# EAGLE design PIC32MX250_NU (EAGLE 5.12)
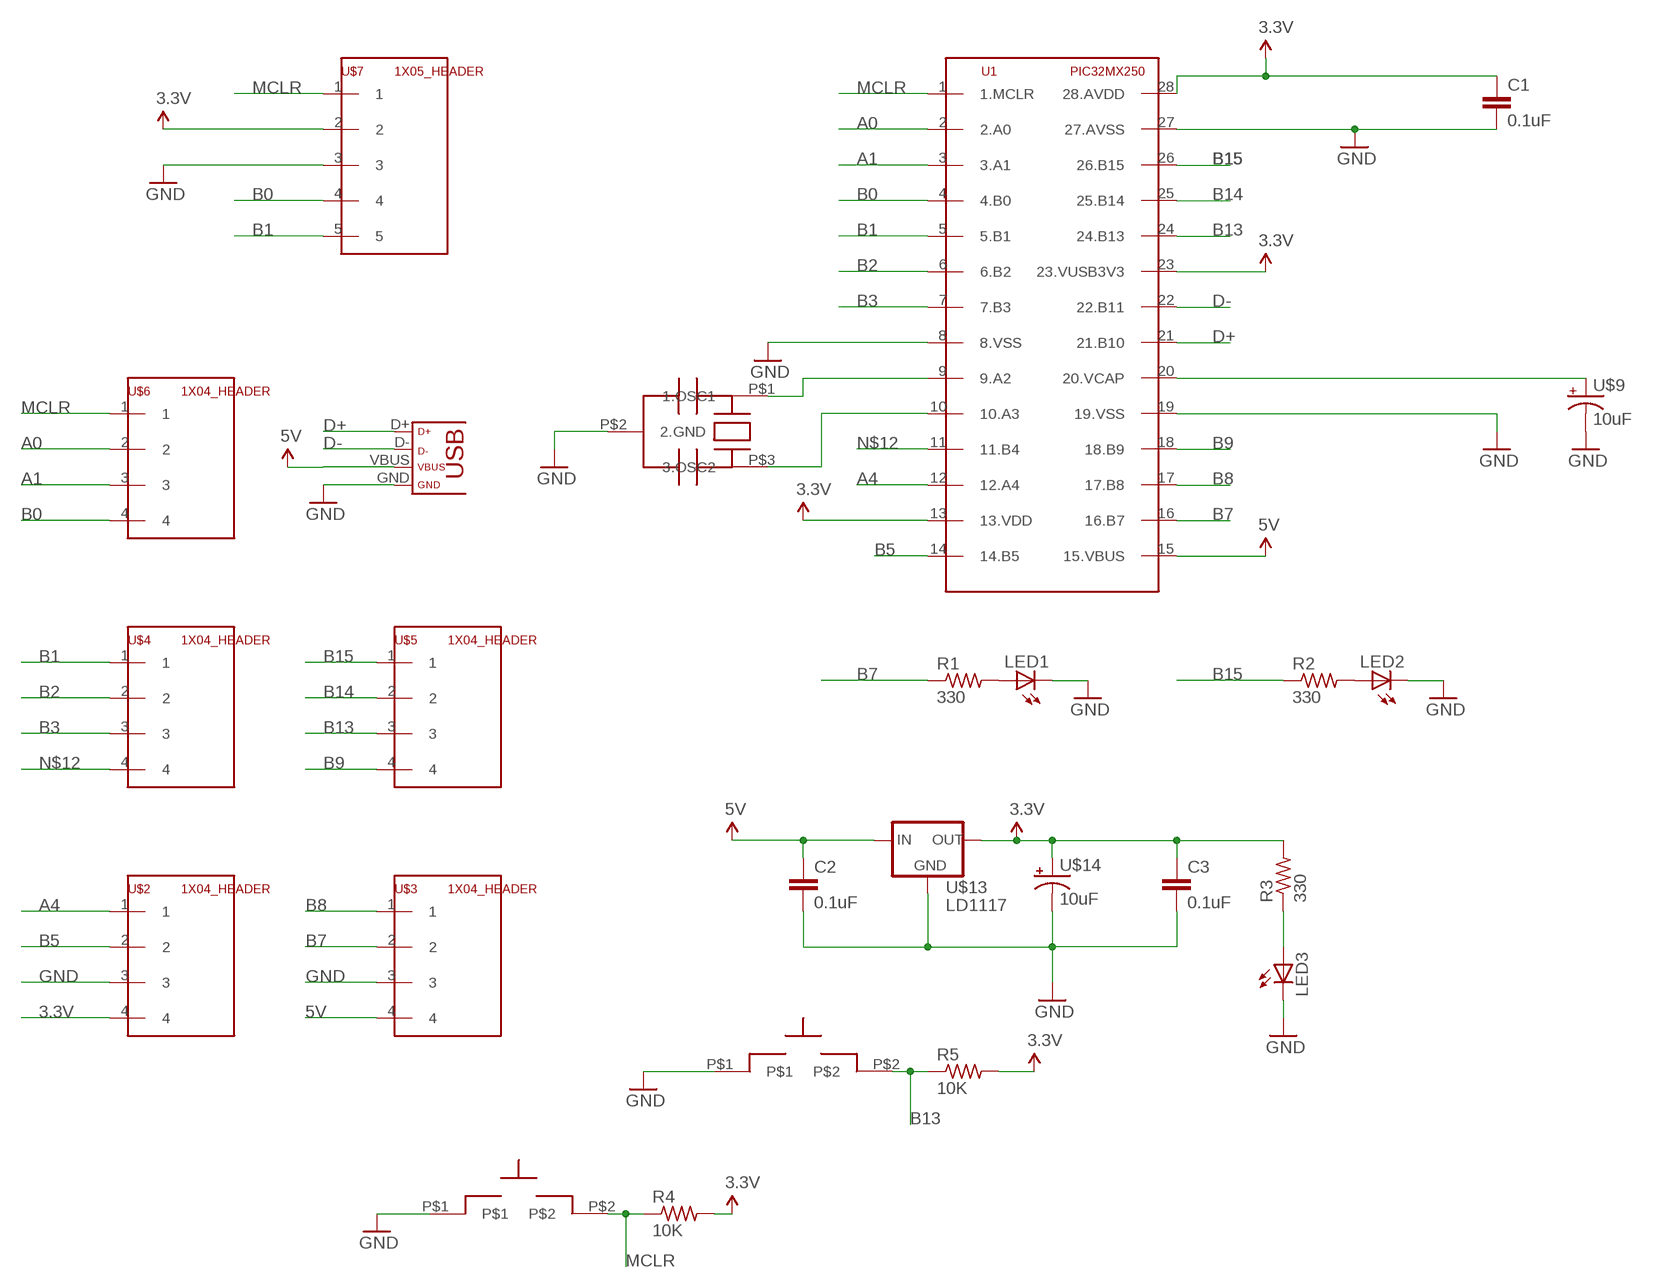
[diagram p0: schematic, sheet 1]

## Parts
C1  0.1uF  C2,5-3  [C2.5-3]
C2  0.1uF  C2,5-3  [C2.5-3]
C3  0.1uF  C2,5-3  [C2.5-3]
LED1  LED3MM  [LED3MM]
LED2  LED3MM  [LED3MM]
LED3  LED3MM  [LED3MM]
R1  330  R-US_0309/12  [0309/12]
R2  330  R-US_0309/12  [0309/12]
R3  330  R-US_0309/12  [0309/12]
R4  10K  R-US_0309/12  [0309/12]
R5  10K  R-US_0309/12  [0309/12]
U1  PIC32MX250  [DIL28-3]
U$2  1X04_HEADER  [1X04]
U$3  1X04_HEADER  [1X04]
U$4  1X04_HEADER  [1X04]
U$5  1X04_HEADER  [1X04]
U$6  1X04_HEADER  [1X04]
U$7  1X05_HEADER  [1X05]
U$9  10uF  CAP_POL  [CAP_POL_D]
U$11  USB  [USB-MINIB]
U$13  LD1117  [TO220]
U$14  10uF  CAP_POL  [CAP_POL_D]
U$15  8MHZ_RESONATOR  [8MHZ_RESONATOR]
U$16  BUTTON  [BUTTON]
U$17  BUTTON  [BUTTON]

## Nets
3.3V: C1.1 C3.1 R3.2 R4.2 R5.2 U1.13(13.VDD) U1.23(23.VUSB3V3) U1.28(28.AVDD) U$2.4 U$7.2 U$13.2(OUT) U$14.1(+)
5V: C2.1 U1.15(15.VBUS) U$3.4 U$11.VBUS U$13.3(IN)
A0: U1.2(2.A0) U$6.2
A1: U1.3(3.A1) U$6.3
A4: U1.12(12.A4) U$2.1
B0: U1.4(4.B0) U$6.4 U$7.4
B1: U1.5(5.B1) U$4.1 U$7.5
B2: U1.6(6.B2) U$4.2
B3: U1.7(7.B3) U$4.3
B5: U1.14(14.B5) U$2.2
B7: R1.1 U1.16(16.B7) U$3.2
B8: U1.17(17.B8) U$3.1
B9: U1.18(18.B9) U$5.4
B13: R5.1 U1.24(24.B13) U$5.3 U$16.P$2
B14: U1.25(25.B14) U$5.2
B15: R2.1 U1.26(26.B15) U$5.1
D+: U1.21(21.B10) U$11.D+
D-: U1.22(22.B11) U$11.D-
GND: C1.2 C2.2 C3.2 LED1.K(C) LED2.K(C) LED3.K(C) U1.8(8.VSS) U1.19(19.VSS) U1.27(27.AVSS) U$2.3 U$3.3 U$7.3 U$9.2(-) U$11.GND U$13.1(GND) U$14.2(-) U$15.P$2(2.GND) U$16.P$1 U$17.P$1
MCLR: R4.1 U1.1(1.MCLR) U$6.1 U$7.1 U$17.P$2
N$2: U1.9(9.A2) U$15.P$1(1.OSC1)
N$3: U1.20(20.VCAP) U$9.1(+)
N$4: LED1.A R1.2
N$5: LED2.A R2.2
N$6: LED3.A R3.1
N$11: U1.10(10.A3) U$15.P$3(3.OSC2)
N$12: U1.11(11.B4) U$4.4

## Library data of the parts
C1-C3 = ME433:C: CAPACITOR naming: grid - package width
LED1-LED3 = led:LED: LED OSRAM: - CHIPLED LG R971, LG N971, LY N971, LG Q971, LY Q971, LO R971, LY R971 LH N974, LH R974 LS Q976, LO Q976, LY Q976 LO Q996 - Hyper CHIPLED LW Q18S LB Q993, LB Q99A, LB R99A - SideLED LS A670, LO A670, LY A670, LG A670, LP A670 LB A673, LV A673, LT A673, LW A673 LH A674 LY A675 LS A676, LA A676, LO A676, LY A676, LW A676 LS A679, LY A679, LG A679 - Hyper Micro SIDELED® LS Y876, LA Y876, LO Y876, LY Y876 LT Y87S - SmartLED LW L88C, LW L88S LB L89C, LB L89S, LG L890 LS L89K, LO L89K, LY L89K LS L896, LA L896, LO L896, LY L896 - TOPLED LS T670, LO T670, LY T670, LG T670, LP T670 LSG T670, LSP T670, LSY T670, LOP T670, LYG T670 LG T671, LOG T671, LSG T671 LB T673, LV T673, LT T673, LW T673 LH T674 LS T676, LA T676, LO T676, LY T676, LB T676, LH T676, LSB T676, LW T676 LB T67C, LV T67C, LT T67C, LS T67K, LO T67K, LY T67K, LW E67C LS E67B, LA E67B, LO E67B, LY E67B, LB E67C, LV E67C, LT E67C LW T67C LS T679, LY T679, LG T679 LS T770, LO T770, LY T770, LG T770, LP T770 LB T773, LV T773, LT T773, LW T773 LH T774 LS E675, LA E675, LY E675, LS T675 LS T776, LA T776, LO T776, LY T776, LB T776 LHGB T686 LT T68C, LB T68C - Hyper Mini TOPLED® LB M676 - Mini TOPLED Santana® LG M470 LS M47K, LO M47K, LY M47K Source: http://www.osram.convergy.de LUXEON: - LUMILED® LXK2-PW12-R00, LXK2-PW12-S00, LXK2-PW14-U00, LXK2-PW14-V00 LXK2-PM12-R00, LXK2-PM12-S00, LXK2-PM14-U00 LXK2-PE12-Q00, LXK2-PE12-R00, LXK2-PE12-S00, LXK2-PE14-T00, LXK2-PE14-U00 LXK2-PB12-K00, LXK2-PB12-L00, LXK2-PB12-M00, LXK2-PB14-N00, LXK2-PB14-P00, LXK2-PB14-Q00 LXK2-PR12-L00, LXK2-PR12-M00, LXK2-PR14-Q00, LXK2-PR14-R00 LXK2-PD12-Q00, LXK2-PD12-R00, LXK2-PD12-S00 LXK2-PH12-R00, LXK2-PH12-S00 LXK2-PL12-P00, LXK2-PL12-Q00, LXK2-PL12-R00 Source: www.luxeon.com KINGBRIGHT: KA-3528ASYC Source: www.kingbright.com
R1-R5 = ME433:R-US_: RESISTOR, American symbol
U1 = ME433:PIC32MX250
U$2-U$6 = ME433:1X04_HEADER
U$7 = ME433:1X05_HEADER
U$9 U$14 = ME433:CAP_POL
U$11 = ME433:USB
U$13 = ME433:LD1117
U$15 = ME433:8MHZ_RESONATOR
U$16 U$17 = ME433:BUTTON

## Board
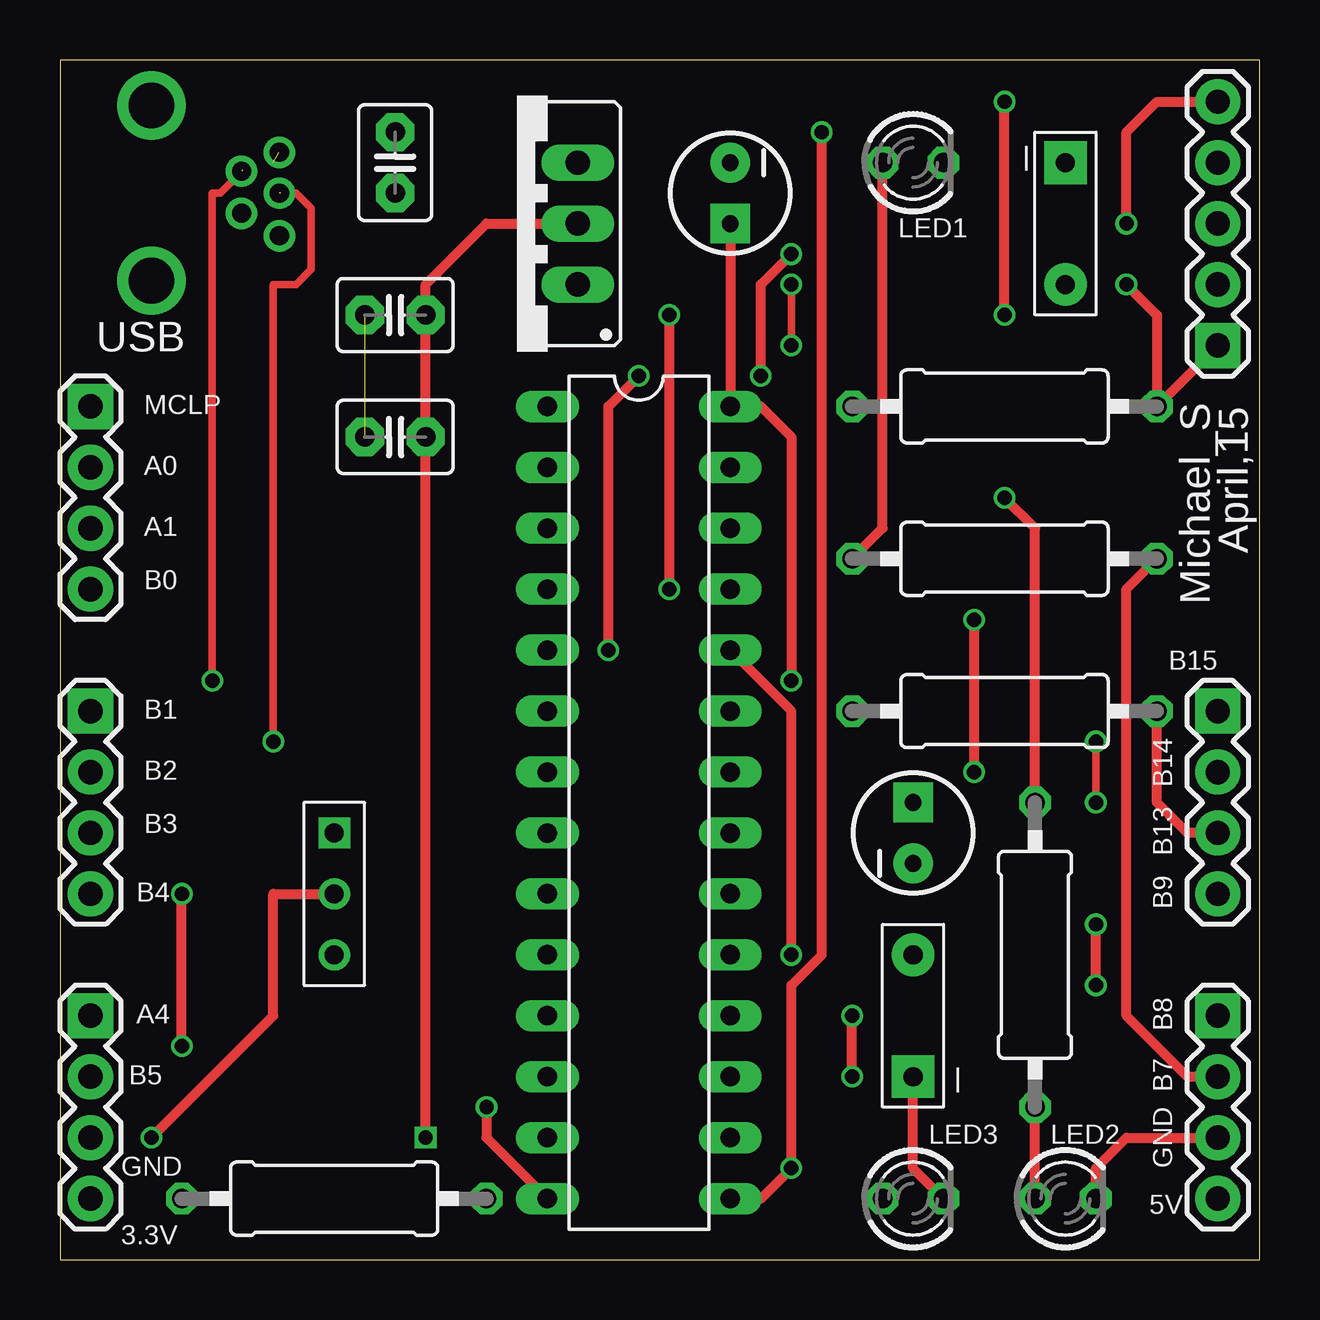
[diagram p1: board, top side]
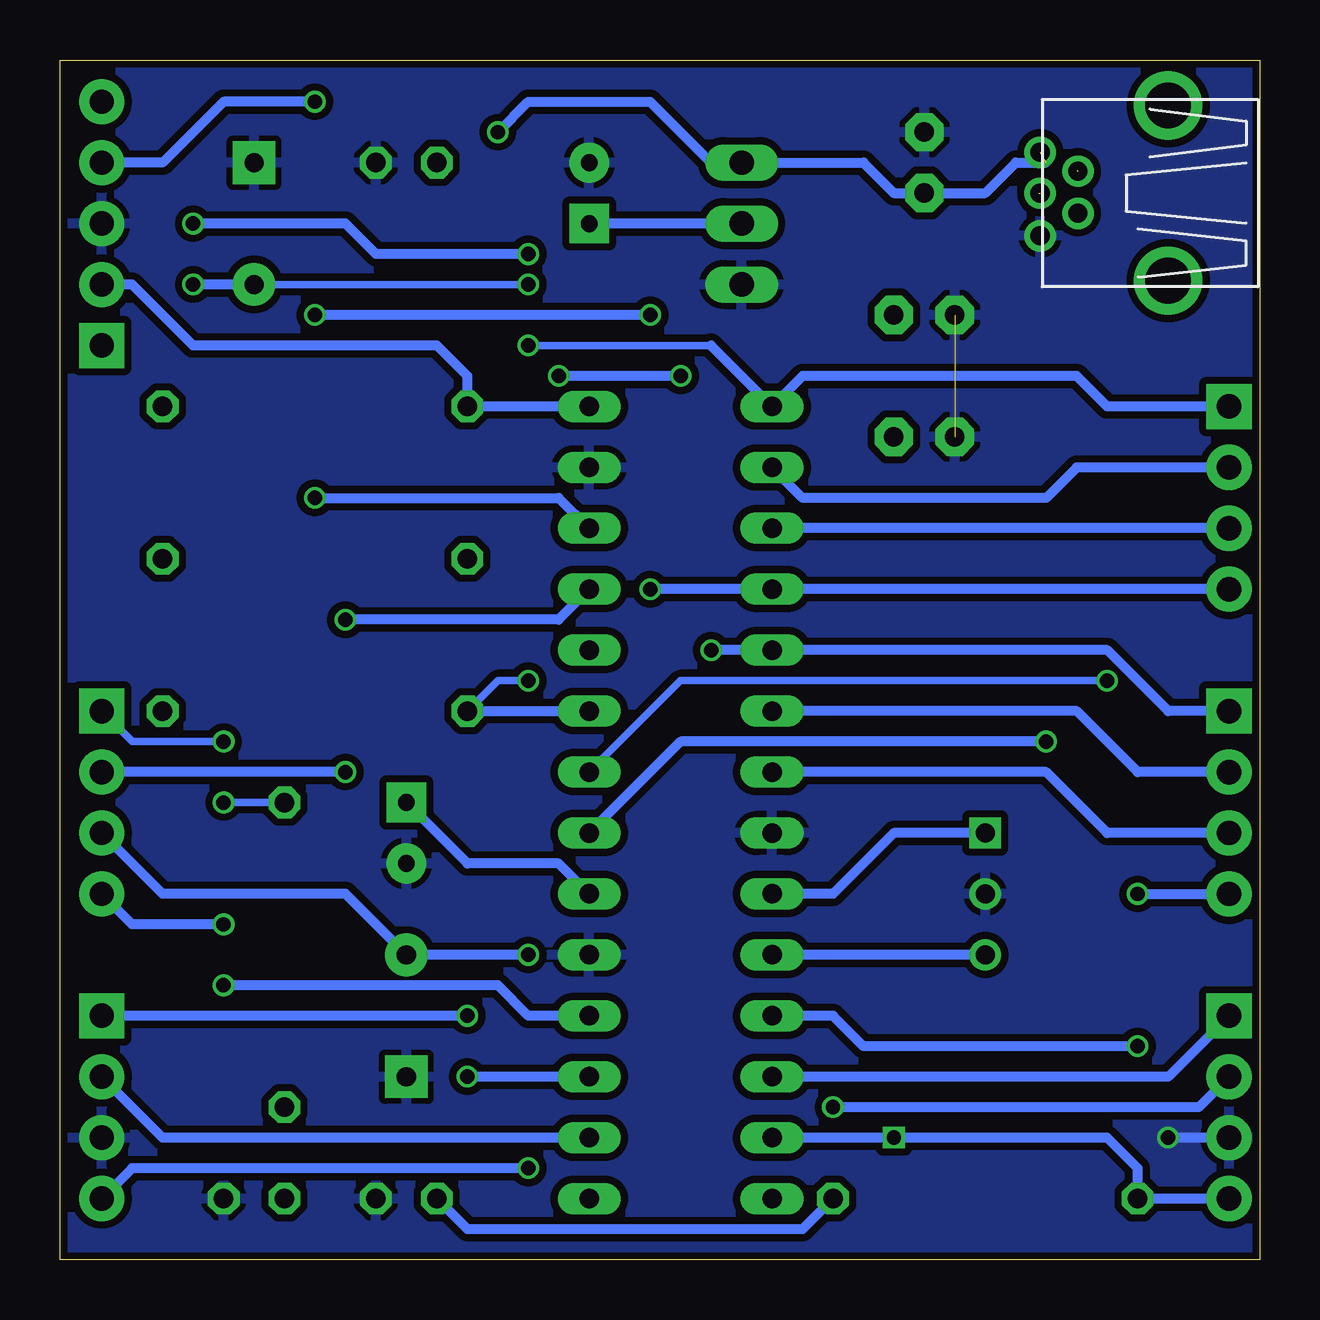
[diagram p2: board, bottom side, seen from below]

Size 50 x 50 mm. Coordinates in mm from the lower left corner, seen from the top.
Outline: 0,0 50,0 50,50 0,50 0,0
Copper layers (1*16): Top 0.035mm / dielectric 1.5mm / Bottom 0.035mm
Design rules "SeeedStudio_2layer_DRU_no_angle_20140221": minimum track width 6mil, minimum drill 12mil, track to track 6mil, track to pad 6mil, pad to pad 6mil, via to via 6mil, smd to smd 0mil, copper to edge 10mil, drill to drill 10mil, minimum pad ring 10mil, minimum via ring 6mil, stop-mask expansion 2mil, vias tented up to drill 100mil, thermal gap 10mil

### Footprints (pad centres in the part's own frame; a part is rotated, then mirrored left to right if it is on the bottom)
C2.5-3 = drill 0.813 pad 1.6 octagon: 1 -1.27,0; 2 1.27,0
LED3MM = drill 0.813 octagon: A -1.27,0; K 1.27,0
0309/12 = drill 0.813 octagon: 1 -6.35,0; 2 6.35,0
DIL28-3 = drill 0.813 long: 1 -16.51,-3.81; 2 -13.97,-3.81; 3 -11.43,-3.81; 4 -8.89,-3.81; 5 -6.35,-3.81; 6 -3.81,-3.81; 7 -1.27,-3.81; 8 1.27,-3.81; 9 3.81,-3.81; 10 6.35,-3.81; 11 8.89,-3.81; 12 11.43,-3.81; 13 13.97,-3.81; 14 16.51,-3.81; 15 16.51,3.81; 16 13.97,3.81; 17 11.43,3.81; 18 8.89,3.81; 19 6.35,3.81; 20 3.81,3.81; 21 1.27,3.81; 22 -1.27,3.81; 23 -3.81,3.81; 24 -6.35,3.81; 25 -8.89,3.81; 26 -11.43,3.81; 27 -13.97,3.81; 28 -16.51,3.81
1X04 = drill 1.016 pad 1.88 square: 1 0,0 | drill 1.016 pad 1.88 round: 2 2.54,0; 3 5.08,0; 4 7.62,0
1X05 = drill 1.016 pad 1.88 square: 1 0,0 | drill 1.016 pad 1.88 round: 2 2.54,0; 3 5.08,0; 4 7.62,0; 5 10.16,0
CAP_POL_D = drill 0.7 pad 1.651 square: 1 1.27,0 | drill 0.7 pad 1.651 round: 2 -1.27,0
USB-MINIB = drill 0.8 round: D+ 4.064,0; D- 2.489,0.914; GND 4.064,-1.778; ID 2.489,-0.838; VBUS 4.064,1.702 | drill 1.9 round: P$6 -1.27,-3.65; P$7 -1.27,3.65
TO220 = drill 1.016 long: 1 -2.54,0; 2 0,0; 3 2.54,0
8MHZ_RESONATOR = drill 0.8 square: P$1 -2.54,0 | drill 0.8 round: P$2 0,0; P$3 2.54,0
BUTTON = drill 0.8 pad 1.778 square: P$1 0,0 | drill 0.8 pad 1.778 round: P$2 5.08,0

### Placement (x,y rotation side)
C1  13.97,39.37 180 top
C2  13.97,45.72 90 top
C3  13.97,34.29 180 top
LED1  35.56,45.72 0 top
LED2  41.91,2.54 0 top
LED3  35.56,2.54 0 top
R1  39.37,29.21 180 top
R2  40.64,12.7 270 top
R3  11.43,2.54 180 top
R4  39.37,35.56 180 top
R5  39.37,22.86 180 top
U1  24.13,19.05 270 top
U$2  1.27,10.16 270 top
U$3  48.26,10.16 270 top
U$4  1.27,22.86 270 top
U$5  48.26,22.86 270 top
U$6  1.27,35.56 270 top
U$7  48.26,38.1 90 top
U$9  35.56,17.78 90 top
U$11  5.08,44.45 0 top
U$13  21.59,43.18 90 top
U$14  27.94,44.45 270 top
U$15  11.43,15.24 270 top
U$16  35.56,7.62 90 top
U$17  41.91,45.72 270 top

### Tracks (layer width: path | path; a pad name or v marks a point on that pad's centre or on a via)
3.3V  (via drill 0.6)
  Top 0.406: U$13.2 17.78,43.18 15.24,40.64 C1.1 C3.1 v15.24,5.08 | U$14.1 U1.28 29.21,35.56 30.48,34.29 v30.48,24.13
  Bottom 0.305: v30.48,24.13 31.75,24.13 R5.2
  Bottom 0.406: U$13.2 U$14.1 | U1.28 R4.2 33.02,36.83 34.29,38.1 44.45,38.1 46.99,40.64 U$7.2 | R5.2 U1.23 | U$2.4 R3.2 5.08,3.81 6.35,5.08 v15.24,5.08 U1.13
5V  (via drill 0.6)  (1 unrouted)
  Top 0.406: v31.75,46.99 31.75,12.7 30.48,11.43 v30.48,3.81 29.21,2.54 U1.15
  Bottom 0.406: 8.89,45.72 10.16,45.72 11.43,44.45 C2.1 15.24,44.45 16.51,45.72 U$13.3 22.86,45.72 25.4,48.26 30.48,48.26 v31.75,46.99 | v30.48,3.81 46.99,3.81 U$3.4
A0
  Bottom 0.406: U$6.2 7.62,33.02 8.89,31.75 19.05,31.75 U1.2
A1
  Bottom 0.406: U$6.3 U1.3
A4
  Bottom 0.406: U$2.1 3.81,7.62 U1.12
B0  (via drill 0.6)
  Top 0.406: v39.37,39.37 v39.37,48.26 | v25.4,27.94 v25.4,39.37
  Bottom 0.406: U$6.4 U1.4 v25.4,27.94 | v39.37,48.26 43.18,48.26 45.72,45.72 U$7.4 | v25.4,39.37 v39.37,39.37
B1  (via drill 0.6)
  Top 0.406: v44.45,43.18 44.45,46.99 45.72,48.26 U$7.5 | v29.21,36.83 29.21,40.64 v30.48,41.91 | v22.86,25.4 22.86,35.56 v24.13,36.83
  Bottom 0.406: U$4.1 3.81,22.86 6.35,25.4 U1.5 v22.86,25.4 | v30.48,41.91 36.83,41.91 38.1,43.18 v44.45,43.18 | v24.13,36.83 v29.21,36.83
B2
  Bottom 0.406: U$4.2 5.08,20.32 7.62,22.86 U1.6
B3
  Bottom 0.406: U$4.3 6.35,17.78 8.89,20.32 U1.7
B5  (via drill 0.6)
  Top 0.406: v17.78,6.35 17.78,5.08 U1.14
  Bottom 0.406: U$2.2 2.54,6.35 v17.78,6.35
B7
  Top 0.406: U$3.2 46.99,7.62 44.45,10.16 44.45,27.94 R1.1
  Bottom 0.406: U1.16 45.72,5.08 U$3.2
B8  (via drill 0.6)
  Top 0.406: v33.02,7.62 v33.02,10.16
  Bottom 0.406: v33.02,10.16 U$3.1 | U1.17 v33.02,7.62
B9  (via drill 0.6)
  Top 0.406: v43.18,11.43 v43.18,13.97
  Bottom 0.406: U1.18 30.48,10.16 31.75,11.43 v43.18,11.43 | v43.18,13.97 46.99,13.97 U$5.4
B13  (via drill 0.6)
  Top 0.406: U1.24 30.48,22.86 v30.48,12.7 | R5.1 45.72,19.05 46.99,17.78 U$5.3
  Bottom 0.406: U$5.3 45.72,15.24 38.1,15.24 U$16.P$2 v30.48,12.7
B14  (via drill 0.6)
  Top 0.406: v38.1,26.67 v38.1,20.32
  Bottom 0.406: v38.1,20.32 U$5.2 | v38.1,26.67 29.21,26.67 U1.25
B15  (via drill 0.6)
  Top 0.305: v43.18,19.05 v43.18,21.59
  Top 0.406: R2.1 40.64,30.48 v39.37,31.75
  Bottom 0.305: R2.1 v43.18,19.05 | v43.18,21.59 46.99,21.59 U$5.1
  Bottom 0.406: v39.37,31.75 29.21,31.75 U1.26
D+  (via drill 0.6)  (1 unrouted)
  Top 0.305: v8.89,21.59 8.89,40.64 9.84,40.64 10.48,41.27 10.48,43.81 9.84,44.45 9.21,44.45
  Bottom 0.406: v8.89,21.59 24.13,21.59 U1.21
D-  (via drill 0.6)  (1 unrouted)
  Top 0.305: v6.35,24.13 6.35,44.45 6.67,44.45 7.62,45.4
  Bottom 0.305: v6.35,24.13 24.13,24.13 U1.22
GND  (via drill 0.6)  (1 unrouted)
  Top 0.406: U$16.P$1 35.56,3.81 LED3.K | LED2.K 43.18,3.81 44.45,5.08 U$3.3 | v3.81,5.08 8.89,10.16 8.89,15.24 U$15.P$2
  Bottom 0.406: U$2.3 v3.81,5.08
  pour Bottom (isolate 0.305): 0,49.53 0,0 49.53,0 49.53,49.53
MCLR  (via drill 0.6)
  Top 0.305: v30.48,38.1 v30.48,40.64
  Top 0.406: v44.45,40.64 45.72,39.37 R4.1 U$7.1
  Bottom 0.305: 22.86,38.1 v30.48,38.1 | v30.48,40.64 U$17.P$2
  Bottom 0.406: U$6.1 6.35,35.56 7.62,36.83 19.05,36.83 U1.1 22.86,38.1 | U$17.P$2 v44.45,40.64
N$2
  Bottom 0.406: U$15.P$1 15.24,17.78 17.78,15.24 U1.9
N$3
  Bottom 0.406: U1.20 29.21,16.51 33.02,16.51 U$9.1
N$4
  Top 0.406: LED1.A 34.29,30.48 R1.2
N$5
  Top 0.406: LED2.A R2.2
N$6
  Bottom 0.406: R3.1 19.05,1.27 33.02,1.27 LED3.A
N$11
  Bottom 0.406: U$15.P$3 U1.10
N$12  (via drill 0.6)
  Top 0.406: v5.08,8.89 v5.08,15.24
  Bottom 0.406: v5.08,15.24 U$4.4 | v5.08,8.89 16.51,8.89 17.78,10.16 U1.11

### Text on the board
tPlace: _ | April,15 | MCLP | A0 | A1 | B0 | Michael_S | B15 | B1 | B2 | B14 | B3 | B13 | B4 | B9 | A4 | B8 | B5 | _ | B7 | GND | GND | 5V | 3.3V